# Altium schematic sheet PowCarbinBoard_General.SchDoc
size A3
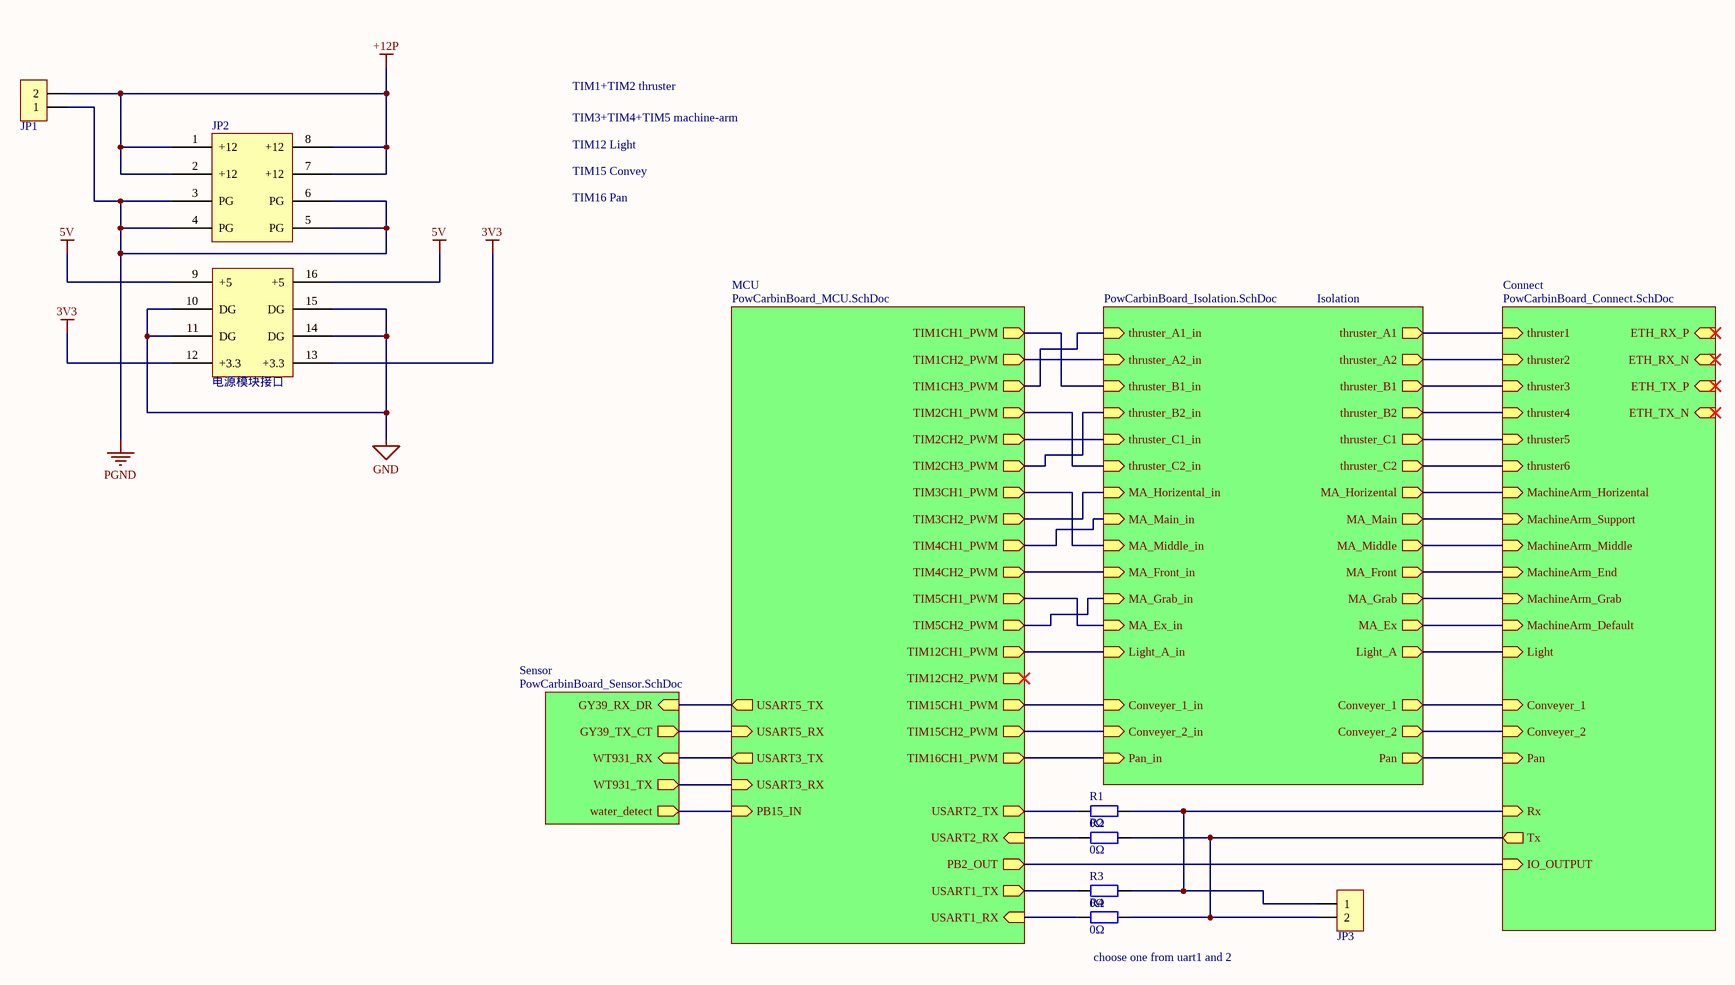
[diagram p0: PowCarbinBoard_General.SchDoc]

## Parts
JP1  HDR-1X2  [KF128-5.08-2P]  (value not drawn)
JP2  电源模块接口  [排针-座 2*4]
JP3  HDR-1X2  [HDR2.54-LI-2P]  (value not drawn)
R1  0Ω  [R 0603_L]
R2  0Ω  [R 0603_L]
R3  0Ω  [R 0603_L]
R4  0Ω  [R 0603_L]

## Sub-sheets
Connect = PowCarbinBoard_Connect.SchDoc: MachineArm_End (in), MachineArm_Default (in), ETH_TX_P (in), MachineArm_Grab (in), Conveyer_2 (in), IO_OUTPUT (in), Conveyer_1 (in), ETH_RX_P (in), MachineArm_Support (in), ETH_RX_N (in), thruster6 (in), Rx (in), thruster1 (in), ETH_TX_N (in), MachineArm_Horizental (in), Light (in), thruster5 (in), MachineArm_Middle (in), Tx (out), thruster3 (in), thruster2 (in), Pan (in), thruster4 (in)
Isolation = PowCarbinBoard_Isolation.SchDoc: thruster_A2_in (in), MA_Grab (out), Conveyer_1 (out), MA_Ex_in (in), MA_Middle_in (in), thruster_B2 (out), thruster_C2_in (in), MA_Ex (out), thruster_A1 (out), thruster_B2_in (in), MA_Front_in (in), thruster_A1_in (in), Pan (out), Light_A_in (in), MA_Main (out), MA_Middle (out), thruster_C1_in (in), thruster_B1_in (in), MA_Front (out), Light_A (out), thruster_B1 (out), thruster_C1 (out), thruster_C2 (out), Pan_in (in), Conveyer_2_in (in), MA_Grab_in (in), MA_Main_in (in), thruster_A2 (out), Conveyer_2 (out), MA_Horizental (out), MA_Horizental_in (in), Conveyer_1_in (in)
MCU = PowCarbinBoard_MCU.SchDoc: TIM4CH1_PWM (out), TIM3CH2_PWM (out), USART2_RX (in), TIM3CH1_PWM (out), TIM2CH3_PWM (out), TIM2CH2_PWM (out), TIM2CH1_PWM (out), TIM1CH2_PWM (out), TIM1CH3_PWM (out), USART2_TX (out), TIM1CH1_PWM (out), USART1_RX (in), USART1_TX (out), USART3_RX (in), USART5_RX (in), USART3_TX (out), TIM5CH2_PWM (out), TIM12CH1_PWM (out), USART5_TX (out), TIM15CH2_PWM (out), TIM16CH1_PWM (out), TIM5CH1_PWM (out), TIM4CH2_PWM (out), TIM12CH2_PWM (out), TIM15CH1_PWM (out), PB2_OUT (out), PB15_IN (in)
Sensor = PowCarbinBoard_Sensor.SchDoc: water_detect (out), GY39_TX_CT (out), WT931_RX (in), GY39_RX_DR (in), WT931_TX (out)

## Nets
3V3: JP2.12(+3.3) JP2.13(+3.3)
5V: JP2.9(+5) JP2.16(+5)
+12P: JP1.2 JP2.1(+12) JP2.2(+12) JP2.7(+12) JP2.8(+12)
GND: JP2.10(DG) JP2.11(DG) JP2.14(DG) JP2.15(DG)
PGND: JP1.1 JP2.3(PG) JP2.4(PG) JP2.5(PG) JP2.6(PG)
NetJP3_1: JP3.1 R1.2 R3.2 ; sheet Connect/Rx
NetJP3_2: JP3.2 R2.2 R4.2 ; sheet Connect/Tx
NetR1_1: R1.1 ; sheet MCU/USART2_TX
NetR2_1: R2.1 ; sheet MCU/USART2_RX
NetR3_1: R3.1 ; sheet MCU/USART1_TX
NetR4_1: R4.1 ; sheet MCU/USART1_RX
(unnamed): sheet MCU/TIM4CH1_PWM, sheet Isolation/MA_Main_in
(unnamed): sheet MCU/TIM3CH2_PWM, sheet Isolation/MA_Horizental_in
(unnamed): sheet MCU/TIM3CH1_PWM, sheet Isolation/MA_Middle_in
(unnamed): sheet MCU/TIM2CH3_PWM, sheet Isolation/thruster_B2_in
(unnamed): sheet MCU/TIM2CH2_PWM, sheet Isolation/thruster_C1_in
(unnamed): sheet MCU/TIM2CH1_PWM, sheet Isolation/thruster_C2_in
(unnamed): sheet MCU/TIM1CH2_PWM, sheet Isolation/thruster_A2_in
(unnamed): sheet MCU/TIM1CH3_PWM, sheet Isolation/thruster_A1_in
(unnamed): sheet MCU/TIM1CH1_PWM, sheet Isolation/thruster_B1_in
(unnamed): sheet MCU/USART3_RX, sheet Sensor/WT931_TX
(unnamed): sheet MCU/USART5_RX, sheet Sensor/GY39_TX_CT
(unnamed): sheet MCU/USART3_TX, sheet Sensor/WT931_RX
(unnamed): sheet MCU/TIM5CH2_PWM, sheet Isolation/MA_Grab_in
(unnamed): sheet MCU/TIM12CH1_PWM, sheet Isolation/Light_A_in
(unnamed): sheet MCU/USART5_TX, sheet Sensor/GY39_RX_DR
(unnamed): sheet MCU/TIM15CH2_PWM, sheet Isolation/Conveyer_2_in
(unnamed): sheet MCU/TIM16CH1_PWM, sheet Isolation/Pan_in
(unnamed): sheet MCU/TIM5CH1_PWM, sheet Isolation/MA_Ex_in
(unnamed): sheet MCU/TIM4CH2_PWM, sheet Isolation/MA_Front_in
(unnamed): sheet MCU/TIM15CH1_PWM, sheet Isolation/Conveyer_1_in
(unnamed): sheet MCU/PB2_OUT, sheet Connect/IO_OUTPUT
(unnamed): sheet MCU/PB15_IN, sheet Sensor/water_detect
(unnamed): sheet Connect/MachineArm_End, sheet Isolation/MA_Front
(unnamed): sheet Connect/MachineArm_Default, sheet Isolation/MA_Ex
(unnamed): sheet Connect/MachineArm_Grab, sheet Isolation/MA_Grab
(unnamed): sheet Connect/Conveyer_2, sheet Isolation/Conveyer_2
(unnamed): sheet Connect/Conveyer_1, sheet Isolation/Conveyer_1
(unnamed): sheet Connect/MachineArm_Support, sheet Isolation/MA_Main
(unnamed): sheet Connect/thruster6, sheet Isolation/thruster_C2
(unnamed): sheet Connect/thruster1, sheet Isolation/thruster_A1
(unnamed): sheet Connect/MachineArm_Horizental, sheet Isolation/MA_Horizental
(unnamed): sheet Connect/Light, sheet Isolation/Light_A
(unnamed): sheet Connect/thruster5, sheet Isolation/thruster_C1
(unnamed): sheet Connect/MachineArm_Middle, sheet Isolation/MA_Middle
(unnamed): sheet Connect/thruster3, sheet Isolation/thruster_B1
(unnamed): sheet Connect/thruster2, sheet Isolation/thruster_A2
(unnamed): sheet Connect/Pan, sheet Isolation/Pan
(unnamed): sheet Connect/thruster4, sheet Isolation/thruster_B2

## Notes on the sheet
- TIM1+TIM2 thruster
- TIM3+TIM4+TIM5 machine-arm
- TIM12 Light
- TIM15 Convey
- TIM16 Pan
- (near R4) choose one from uart1 and 2

## Library data of the parts
JP1 JP3 = Header 2: 2P接插件; 版权归属: 源创客; BOM名称: 2P接插件; 学习资源: www.ooocke.com
R1-R4 = R: 贴片电阻; 版权归属: 源创客; BOM名称: 贴片电阻; 学习资源: www.ooocke.com